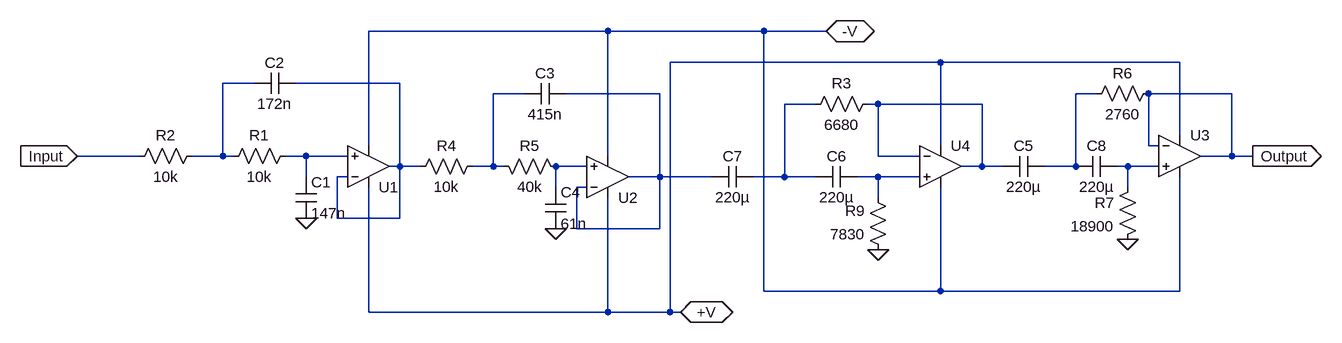
[diagram p0: schematic BandPassFilter - Chev 2do orden.asc]
BandPassFilter - Chev 2do orden.asc, the LTspice schematic file:
Version 4
SHEET 1 1844 680
WIRE 496 -16 128 -16
WIRE 736 -16 496 -16
WIRE 832 -16 736 -16
WIRE 1008 32 592 32
WIRE 1376 32 1008 32
WIRE -48 64 -96 64
WIRE 176 64 16 64
WIRE 368 80 320 80
WIRE 576 80 432 80
WIRE 1248 80 1216 80
WIRE 1456 80 1328 80
WIRE 816 96 768 96
WIRE 912 96 896 96
WIRE 1072 96 912 96
WIRE 1376 144 1376 32
WIRE 128 160 128 -16
WIRE 1008 160 1008 32
WIRE 1328 160 1328 80
WIRE 1344 160 1328 160
WIRE -224 176 -320 176
WIRE -96 176 -96 64
WIRE -96 176 -144 176
WIRE -80 176 -96 176
WIRE 32 176 0 176
WIRE 96 176 32 176
WIRE 496 176 496 -16
WIRE 912 176 912 96
WIRE 976 176 912 176
WIRE 1456 176 1456 80
WIRE 1456 176 1408 176
WIRE 1488 176 1456 176
WIRE 176 192 176 64
WIRE 176 192 160 192
WIRE 208 192 176 192
WIRE 320 192 320 80
WIRE 320 192 288 192
WIRE 336 192 320 192
WIRE 464 192 416 192
WIRE 1072 192 1072 96
WIRE 1072 192 1040 192
WIRE 1104 192 1072 192
WIRE 1216 192 1216 80
WIRE 1216 192 1168 192
WIRE 1296 192 1280 192
WIRE 1344 192 1296 192
WIRE 1488 192 1488 176
WIRE 32 208 32 176
WIRE 96 208 80 208
WIRE 576 208 576 80
WIRE 576 208 528 208
WIRE 656 208 576 208
WIRE 768 208 768 96
WIRE 768 208 720 208
WIRE 816 208 768 208
WIRE 912 208 880 208
WIRE 976 208 912 208
WIRE 416 224 416 192
WIRE 464 224 448 224
WIRE 1296 224 1296 192
WIRE 912 240 912 208
WIRE 80 272 80 208
WIRE 176 272 176 192
WIRE 176 272 80 272
WIRE 448 288 448 224
WIRE 576 288 576 208
WIRE 576 288 448 288
WIRE 736 384 736 -16
WIRE 1008 384 1008 224
WIRE 1008 384 736 384
WIRE 1376 384 1376 208
WIRE 1376 384 1008 384
WIRE 128 416 128 224
WIRE 496 416 496 240
WIRE 496 416 128 416
WIRE 592 416 592 32
WIRE 592 416 496 416
WIRE 608 416 592 416
FLAG 416 288 0
FLAG 32 272 0
FLAG 1296 304 0
FLAG 912 320 0
FLAG -320 176 Input
IOPIN -320 176 In
FLAG 1488 176 Output
IOPIN 1488 176 Out
FLAG 608 416 +V
IOPIN 608 416 BiDir
FLAG 832 -16 -V
IOPIN 832 -16 BiDir
SYMBOL Opamps\\UniversalOpAmp 496 208 M180
SYMATTR InstName U2
SYMBOL res -128 160 R90
WINDOW 0 0 56 VBottom 2
WINDOW 3 32 56 VTop 2
SYMATTR InstName R2
SYMATTR Value 10k
SYMBOL res 304 176 R90
WINDOW 0 0 56 VBottom 2
WINDOW 3 32 56 VTop 2
SYMATTR InstName R4
SYMATTR Value 10k
SYMBOL res 320 176 M90
WINDOW 0 0 56 VBottom 2
WINDOW 3 32 56 VTop 2
SYMATTR InstName R5
SYMATTR Value 40k
SYMBOL cap 368 64 M90
WINDOW 0 0 32 VBottom 2
WINDOW 3 32 32 VTop 2
SYMATTR InstName C3
SYMATTR Value 415n
SYMBOL cap 16 208 R0
SYMATTR InstName C1
SYMATTR Value 147n
SYMBOL res 16 160 R90
WINDOW 0 0 56 VBottom 2
WINDOW 3 32 56 VTop 2
SYMATTR InstName R1
SYMATTR Value 10k
SYMBOL cap 16 48 R90
WINDOW 0 0 32 VBottom 2
WINDOW 3 32 32 VTop 2
SYMATTR InstName C2
SYMATTR Value 172n
SYMBOL Opamps\\UniversalOpAmp 128 192 M180
SYMATTR InstName U1
SYMBOL cap 400 224 R0
SYMATTR InstName C4
SYMATTR Value 61n
SYMBOL Opamps\\UniversalOpAmp 1376 176 R0
SYMATTR InstName U3
SYMBOL res 912 80 R90
WINDOW 0 0 56 VBottom 2
WINDOW 3 32 56 VTop 2
SYMATTR InstName R3
SYMATTR Value 6680
SYMBOL res 1344 64 R90
WINDOW 0 0 56 VBottom 2
WINDOW 3 32 56 VTop 2
SYMATTR InstName R6
SYMATTR Value 2760
SYMBOL res 1312 208 M0
SYMATTR InstName R7
SYMATTR Value 18900
SYMBOL cap 1104 176 M90
WINDOW 0 0 32 VBottom 2
WINDOW 3 32 32 VTop 2
SYMATTR InstName C5
SYMATTR Value 220µ
SYMBOL cap 880 192 R90
WINDOW 0 0 32 VBottom 2
WINDOW 3 32 32 VTop 2
SYMATTR InstName C6
SYMATTR Value 220µ
SYMBOL res 928 336 R180
WINDOW 0 36 76 Left 2
WINDOW 3 36 40 Left 2
SYMATTR InstName R9
SYMATTR Value 7830
SYMBOL cap 720 192 R90
WINDOW 0 0 32 VBottom 2
WINDOW 3 32 32 VTop 2
SYMATTR InstName C7
SYMATTR Value 220µ
SYMBOL Opamps\\UniversalOpAmp 1008 192 R0
SYMATTR InstName U4
SYMBOL cap 1280 176 R90
WINDOW 0 0 32 VBottom 2
WINDOW 3 32 32 VTop 2
SYMATTR InstName C8
SYMATTR Value 220µ

The netlist it stands for:
* BandPassFilter - Chev 2do orden.asc
XU2 N009 N004 +V -V N004 level1 Avol=1Meg GBW=10Meg Vos=0 En=0 Enk=0 In=0 Ink=0 Rin=500Meg  ; pins In+ In- V+ V- OUT
R2 N001 Input 10k
R4 N003 N002 10k
R5 N003 N009 40k
C3 N003 N004 415n
C1 N008 0 147n
R1 N008 N001 10k
C2 N002 N001 172n
XU1 N008 N002 +V -V N002 level1 Avol=1Meg GBW=10Meg Vos=0 En=0 Enk=0 In=0 Ink=0 Rin=500Meg  ; pins In+ In- V+ V- OUT
C4 N009 0 61n
XU3 N010 Output +V -V Output level1 Avol=1Meg GBW=10Meg Vos=0 En=0 Enk=0 In=0 Ink=0 Rin=500Meg  ; pins In+ In- V+ V- OUT
R3 N007 N006 6680
R6 Output N005 2760
R7 N010 0 18900
C5 N007 N005 220µ
C6 N011 N006 220µ
R9 0 N011 7830
C7 N006 N004 220µ
XU4 N011 N007 +V -V N007 level1 Avol=1Meg GBW=10Meg Vos=0 En=0 Enk=0 In=0 Ink=0 Rin=500Meg  ; pins In+ In- V+ V- OUT
C8 N010 N005 220µ
.lib UniversalOpAmp1.lib
.backanno
.end